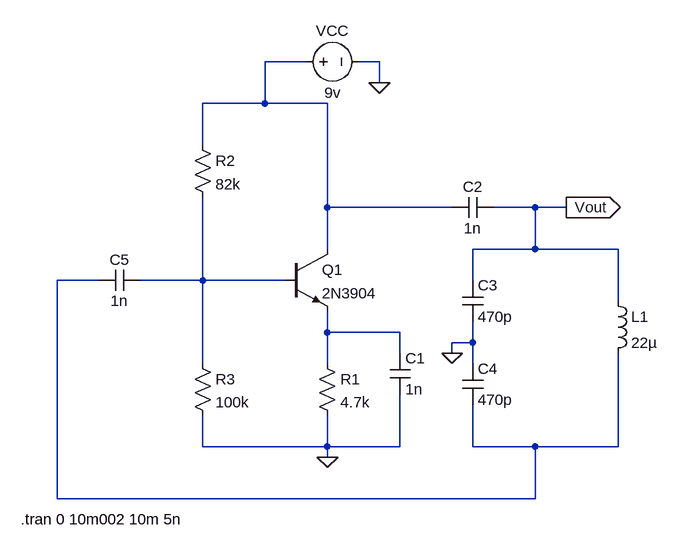
[diagram p0: schematic B20027_Collpits.asc]
B20027_Collpits.asc, the LTspice schematic file:
Version 4
SHEET 1 880 680
WIRE 192 -128 128 -128
WIRE 304 -128 272 -128
WIRE 304 -96 304 -128
WIRE 128 -64 128 -128
WIRE 128 -64 32 -64
WIRE 224 -64 128 -64
WIRE 32 0 32 -64
WIRE 224 96 224 -64
WIRE 416 96 224 96
WIRE 544 96 480 96
WIRE 592 96 544 96
WIRE 224 160 224 96
WIRE 544 160 544 96
WIRE 544 160 448 160
WIRE 672 160 544 160
WIRE -128 208 -192 208
WIRE 32 208 32 80
WIRE 32 208 -64 208
WIRE 160 208 32 208
WIRE 448 208 448 160
WIRE 672 240 672 160
WIRE 224 288 224 256
WIRE 336 288 224 288
WIRE 448 304 448 272
WIRE 448 304 416 304
WIRE 336 320 336 288
WIRE 416 320 416 304
WIRE 32 336 32 208
WIRE 224 336 224 288
WIRE 448 336 448 304
WIRE 32 464 32 416
WIRE 224 464 224 416
WIRE 224 464 32 464
WIRE 336 464 336 384
WIRE 336 464 224 464
WIRE 448 464 448 400
WIRE 544 464 448 464
WIRE 672 464 672 320
WIRE 672 464 544 464
WIRE 224 480 224 464
WIRE -192 544 -192 208
WIRE 544 544 544 464
WIRE 544 544 -192 544
FLAG 224 480 0
FLAG 304 -96 0
FLAG 416 320 0
FLAG 592 96 Vout
IOPIN 592 96 Out
SYMBOL npn 160 160 R0
SYMATTR InstName Q1
SYMATTR Value 2N3904
SYMBOL res 208 320 R0
SYMATTR InstName R1
SYMATTR Value 4.7k
SYMBOL res 16 -16 R0
SYMATTR InstName R2
SYMATTR Value 82k
SYMBOL res 16 320 R0
SYMATTR InstName R3
SYMATTR Value 100k
SYMBOL cap 320 320 R0
SYMATTR InstName C1
SYMATTR Value 1n
SYMBOL cap 480 80 R90
WINDOW 0 0 32 VBottom 2
WINDOW 3 32 32 VTop 2
SYMATTR InstName C2
SYMATTR Value 1n
SYMBOL cap 432 208 R0
SYMATTR InstName C3
SYMATTR Value 470p
SYMBOL cap 432 336 R0
SYMATTR InstName C4
SYMATTR Value 470p
SYMBOL ind 656 224 R0
SYMATTR InstName L1
SYMATTR Value 22µ
SYMBOL cap -64 192 R90
WINDOW 0 0 32 VBottom 2
WINDOW 3 32 32 VTop 2
SYMATTR InstName C5
SYMATTR Value 1n
SYMBOL voltage 176 -128 R270
WINDOW 0 32 56 VTop 2
WINDOW 3 -32 56 VBottom 2
WINDOW 123 0 0 Left 0
WINDOW 39 0 0 Left 0
SYMATTR InstName VCC
SYMATTR Value 9v
TEXT -248 576 Left 2 !.tran 0 10m002 10m 5n

The netlist it stands for:
* B20027_Collpits.asc
Q1 N001 N003 N004 0 2N3904
R1 N004 0 4.7k
R2 N001 N003 82k
R3 N003 0 100k
C1 N004 0 1n
C2 Vout N001 1n
C3 Vout 0 470p
C4 0 N002 470p
L1 Vout N002 22µ
C5 N003 N002 1n
VCC N001 0 9v
.model NPN NPN
.model PNP PNP
.lib standard.bjt
.tran 0 10m002 10m 5n
.backanno
.end